# EAGLE schematic ESP-TemperatureSensor (EAGLE 9.6.2)
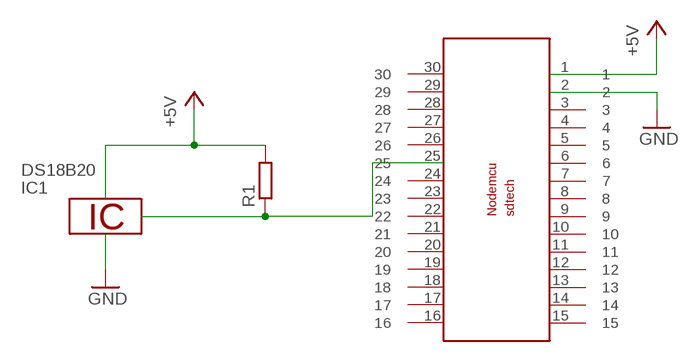
[diagram p0: schematic, sheet 1]

## Parts
IC1  DS18B20  [TO92-]
R1  R-EU_0204/2V  [0204V]
U$1  NODEMCUESP8266  [NODEMCUESP8266]

## Nets
+5V: R1.2 U$1.1
GND: U$1.2
N$1: R1.1 U$1.25
Unconnected: U$1.3 U$1.4 U$1.5 U$1.6 U$1.7 U$1.8 U$1.9 U$1.10 U$1.11 U$1.12 U$1.13 U$1.14 U$1.15 U$1.16 U$1.17 U$1.18 U$1.19 U$1.20 U$1.21 U$1.22 U$1.23 U$1.24 U$1.26 U$1.27 U$1.28 U$1.29 U$1.30

## Power pins joined to a net without a drawn wire
1W: IC1.2
GND: IC1.1
VDD: IC1.3

## Library data of the parts
IC1 = 1wire:DS18B20: Programmable Resolution Digital Thermometer This chip provides a onewire thermosensor with approx. 0.5°C accuracy. A programmable over/undertemperure alarm is available. The precision can be set from 9..12 bits. Notes: Vdd must be applied for accurate measurements at low temperatures, as the parasite power circuit otherwise heats the sensor. If parasite power is used, Vdd has to be connected to GND. The DS1822 is a low-cost thermometer chip, the DS18S20 is similar to the DS18B20, but with 9 Bit precision only. Author: Jan Kandziora <jjj@gmx.de>
R1 = rcl:R-EU_: RESISTOR, European symbol; SPICEPREFIX: R
U$1 = nodemcu:NODEMCUESP8266: Node Mcu esp8266 12E LIBRARY BY SDTECH ROBOTICS (Shubham Devkar Technology Solutions)